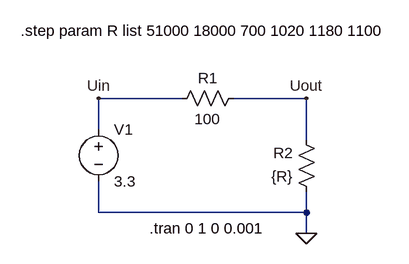
[diagram p0: schematic LDR_simu.asc]
LDR_simu.asc, the LTspice schematic file:
Version 4
SHEET 1 880 680
WIRE 224 64 96 64
WIRE 416 64 304 64
WIRE 96 112 96 64
WIRE 416 128 416 64
WIRE 96 240 96 192
WIRE 416 240 416 208
WIRE 416 240 96 240
WIRE 416 272 416 240
FLAG 416 272 0
FLAG 96 64 Uin
FLAG 416 64 Uout
SYMBOL voltage 96 96 R0
WINDOW 123 0 0 Left 0
WINDOW 39 0 0 Left 0
SYMATTR InstName V1
SYMATTR Value 3.3
SYMBOL res 320 48 R90
WINDOW 0 0 56 VBottom 2
WINDOW 3 32 56 VTop 2
SYMATTR InstName R1
SYMATTR Value 100
SYMATTR SpiceLine tol=1 pwr=0.1
SYMBOL res 432 224 R180
WINDOW 0 36 76 Left 2
WINDOW 3 36 40 Left 2
SYMATTR InstName R2
SYMATTR Value {R}
TEXT -24 -40 Left 2 !.step param R list 51000 18000 700 1020 1180 1100
TEXT 174 264 Left 2 !.tran 0 1 0 0.001

The netlist it stands for:
* LDR_simu.asc
V1 Uin 0 3.3
R1 Uout Uin 100 tol=1 pwr=0.1
R2 0 Uout {R}
.step param R list 51000 18000 700 1020 1180 1100
.tran 0 1 0 0.001
.backanno
.end

* Results of the author's LTspice run, read from the files saved beside the schematic
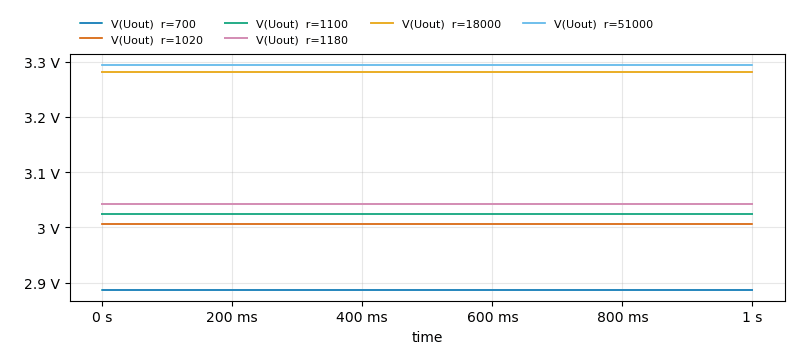
[diagram p1: Transient Analysis of LDR_simu.asc, plotted from the saved traces]
* Transient Analysis, 6 runs:
*   V(Uout) [r=700]: min 2.888 V, max 2.888 V, average 2.888 V, rms 2.888 V, last 2.888 V
*   V(Uout) [r=1020]: min 3.005 V, max 3.005 V, average 3.005 V, rms 3.005 V, last 3.005 V
*   V(Uout) [r=1100]: min 3.025 V, max 3.025 V, average 3.025 V, rms 3.025 V, last 3.025 V
*   V(Uout) [r=1180]: min 3.042 V, max 3.042 V, average 3.042 V, rms 3.042 V, last 3.042 V
*   V(Uout) [r=18000]: min 3.282 V, max 3.282 V, average 3.282 V, rms 3.282 V, last 3.282 V
*   V(Uout) [r=51000]: min 3.294 V, max 3.294 V, average 3.294 V, rms 3.294 V, last 3.294 V